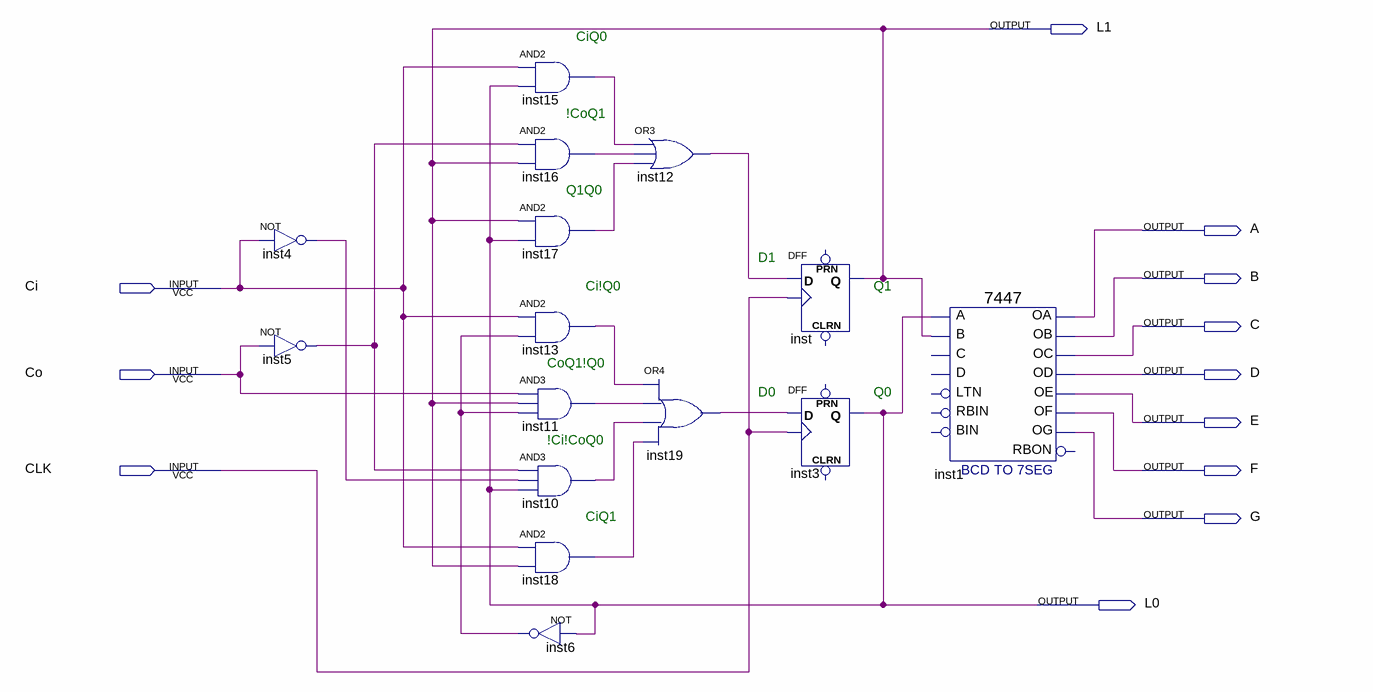
[diagram p0: schematic sheet]
// Quartus schematic exercise1.bdf as structural Verilog: 15 symbols, 12 pins
module exercise1 (
  input  Ci,
  input  Co,
  input  CLK,
  output L1,
  output A,
  output B,
  output C,
  output D,
  output E,
  output F,
  output G,
  output L0
);

  wire inst4_out, inst5_out, inst6_out, inst10_out, inst11_out, inst12_out, inst13_out, inst15_out,
       inst16_out, inst17_out, inst18_out, inst19_out;

  not inst4 (inst4_out, Ci);
  not inst5 (inst5_out, Co);
  and inst15 (inst15_out, Ci, L0);
  and inst16 (inst16_out, inst5_out, L1);
  and inst17 (inst17_out, L1, L0);
  and inst13 (inst13_out, Ci, inst6_out);
  and inst11 (inst11_out, Co, L1, inst6_out);
  and inst10 (inst10_out, inst5_out, inst4_out, L0);
  and inst18 (inst18_out, Ci, L1);
  not inst6 (inst6_out, L0);
  or inst12 (inst12_out, inst15_out, inst16_out, inst17_out);
  or inst19 (inst19_out, inst13_out, inst11_out, inst10_out, inst18_out);
  DFF inst (.CLK(CLK), .D(inst12_out), .Q(L1));  // open: CLRN, PRN
  DFF inst3 (.CLK(CLK), .D(inst19_out), .Q(L0));  // open: CLRN, PRN
  \7447  inst1 (
    .B(L1), .A(L0), .OB(B), .OC(C), .OE(E), .OD(D), .OF(F), .OG(G), .OA(A));  // open: LTN, C, D, RBIN, BIN, RBON

  // Notes on the sheet:
  //   CiQ0
  //   !CoQ1
  //   Q1Q0
  //   D1
  //   Ci!Q0
  //   Q1
  //   CoQ1!Q0
  //   D0
  //   Q0
  //   !Ci!CoQ0
  //   CiQ1
endmodule
